# Altium schematic sheet I2C_Multiplexers.SchDoc
size 863 x 558 mm
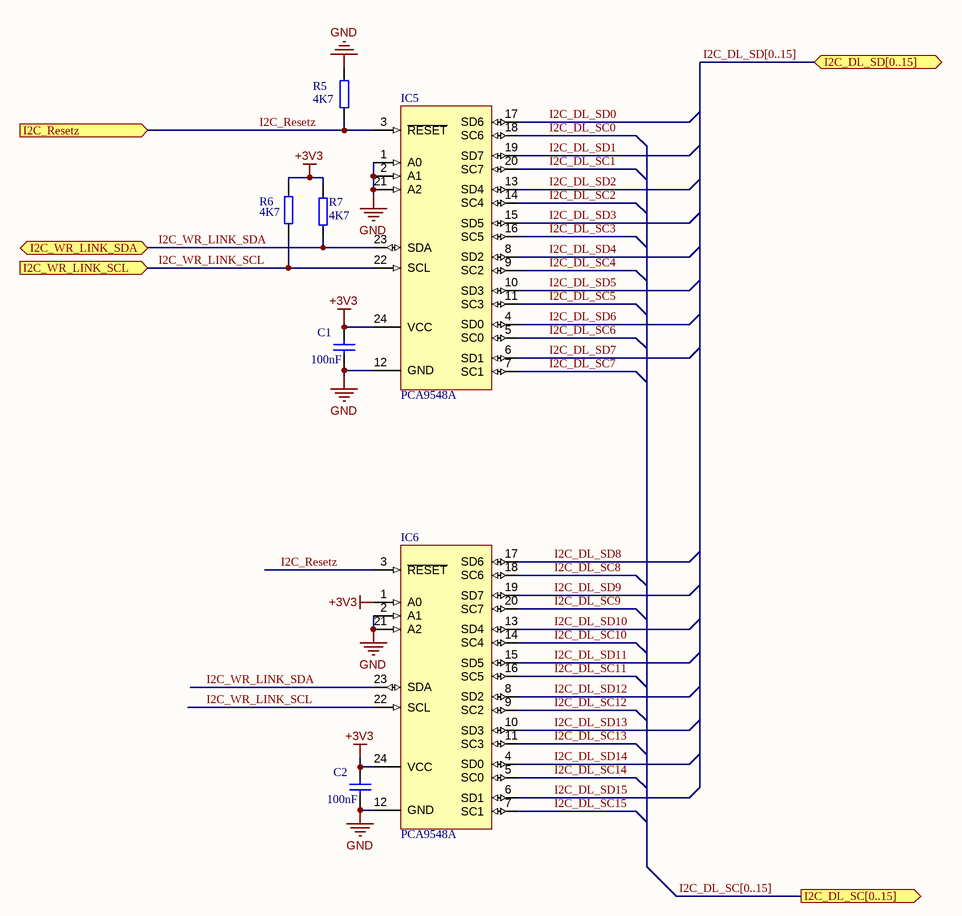
[diagram p0: I2C_Multiplexers.SchDoc]

## Parts
C1  100nF  [CC1608-0603]
C2  100nF  [CC1608-0603]
IC5  PCA9548A  [SOP65P640X120-24N]
IC6  PCA9548A  [SOP65P640X120-24N]
R5  4K7  [0603]
R6  4K7  [0603]
R7  4K7  [0603]

## Ports
I2C_DL_SC[0..15] (out), I2C_DL_SD[0..15] (bidir), I2C_Resetz (in), I2C_WR_LINK_SCL (in), I2C_WR_LINK_SDA (bidir)

## Nets
+3V3: C1.2 C2.2 IC5.24(VCC) IC6.1(A0) IC6.24(VCC) R6.1 R7.1
GND: C1.1 C2.1 IC5.1(A0) IC5.2(A1) IC5.12(GND) IC5.21(A2) IC6.2(A1) IC6.12(GND) IC6.21(A2) R5.2
I2C_DL_SC0: IC5.18(SC6)
I2C_DL_SC1: IC5.20(SC7)
I2C_DL_SC2: IC5.14(SC4)
I2C_DL_SC3: IC5.16(SC5)
I2C_DL_SC4: IC5.9(SC2)
I2C_DL_SC5: IC5.11(SC3)
I2C_DL_SC6: IC5.5(SC0)
I2C_DL_SC7: IC5.7(SC1)
I2C_DL_SC8: IC6.18(SC6)
I2C_DL_SC9: IC6.20(SC7)
I2C_DL_SC10: IC6.14(SC4)
I2C_DL_SC11: IC6.16(SC5)
I2C_DL_SC12: IC6.9(SC2)
I2C_DL_SC13: IC6.11(SC3)
I2C_DL_SC14: IC6.5(SC0)
I2C_DL_SC15: IC6.7(SC1)
I2C_DL_SD0: IC5.17(SD6)
I2C_DL_SD1: IC5.19(SD7)
I2C_DL_SD2: IC5.13(SD4)
I2C_DL_SD3: IC5.15(SD5)
I2C_DL_SD4: IC5.8(SD2)
I2C_DL_SD5: IC5.10(SD3)
I2C_DL_SD6: IC5.4(SD0)
I2C_DL_SD7: IC5.6(SD1)
I2C_DL_SD8: IC6.17(SD6)
I2C_DL_SD9: IC6.19(SD7)
I2C_DL_SD10: IC6.13(SD4)
I2C_DL_SD11: IC6.15(SD5)
I2C_DL_SD12: IC6.8(SD2)
I2C_DL_SD13: IC6.10(SD3)
I2C_DL_SD14: IC6.4(SD0)
I2C_DL_SD15: IC6.6(SD1)
I2C_Resetz: IC5.3(~{RESET}) IC6.3(~{RESET}) R5.1 ; port I2C_Resetz
I2C_WR_LINK_SCL: IC5.22(SCL) IC6.22(SCL) R6.2 ; port I2C_WR_LINK_SCL
I2C_WR_LINK_SDA: IC5.23(SDA) IC6.23(SDA) R7.2 ; port I2C_WR_LINK_SDA

## Buses and harness runs
bus I2C_DL_SC[0..15] = port I2C_DL_SC[0..15]
bus I2C_DL_SD[0..15] = port I2C_DL_SD[0..15]

## Notes on the sheet
- DWG. NO.
- REV.
- SHT.
- REVISION
- DESCRIPTION
- DATE
- APPROVED
- THIS DOCUMENT AND THE DATA DISCLOSED HEREIN OR HEREWITH IS THE PROPERTY OF ALTIUM LIMITED AND MAY BE FREELY DISTRIBUTED IN WHOLE. NO RIGHTS ARE RESERVED OR EXPRESS OR IMPLIED WARANTEE GIVEN.
- ENG:
- DSN:
- APPROVALS
- PROJECT
- DOCUMENT REVISION:
- DESIGN ITEM:
- CHK:
- BOM:
- REFERENCE DOCUMENTS
- PROJECT REVISION:
- TITLE
- FAB DWG:
- PCB DWG:
- ASSY DWG:
- SCALE:
- SIZE
- D
- CAGE CODE
- FILE NAME
- DWG NO.
- SHEET
- OF
- REV

## Library data of the parts
C1 C2 = CC0603_100NF_16V_10%_X7R: Capacitor; Manufacturer1: AVX; Manufacturer1 PN: 0603YC104KAT2A; TC: X7R; Tolerance: ±10%; Voltage: 16V; Published: 8-Jun-2000; LatestRevisionDate: 17-Jul-2002; LatestRevisionNote: Re-released for DXP Platform.; PackageReference: RAD-0.3; Publisher: Altium Limited; Distributor1: Digikey; Distributor1 PN: 478-1239-1-ND; Case: 0603; Value: 100nF
IC5 IC6 = PCA9548A: 8-channel 2C-bus switch with reset; Manufacturer1 PN: PCA9548APW,112; Manufacturer1: NXP Semiconductors; Distributor1: Digikey; Distributor1 PN: 568-3384-5-ND
R5-R7 = R0603_4.7K_±1%_0.1W_100PPM: SMD Resistor; Manufacturer1: Panasonic; Manufacturer1 PN: ERJ-3EKF4701V; TCR: 100ppm; Power Rating: 0.1W; Tolerance: ±1%; Case: 0603; Distributor1: DigiKey; Distributor1 PN: P4.70KHCT-ND; Value: 4K7